# EAGLE design TinyLispComputer (EAGLE 7.6.0)

## Sheet 1 of 2
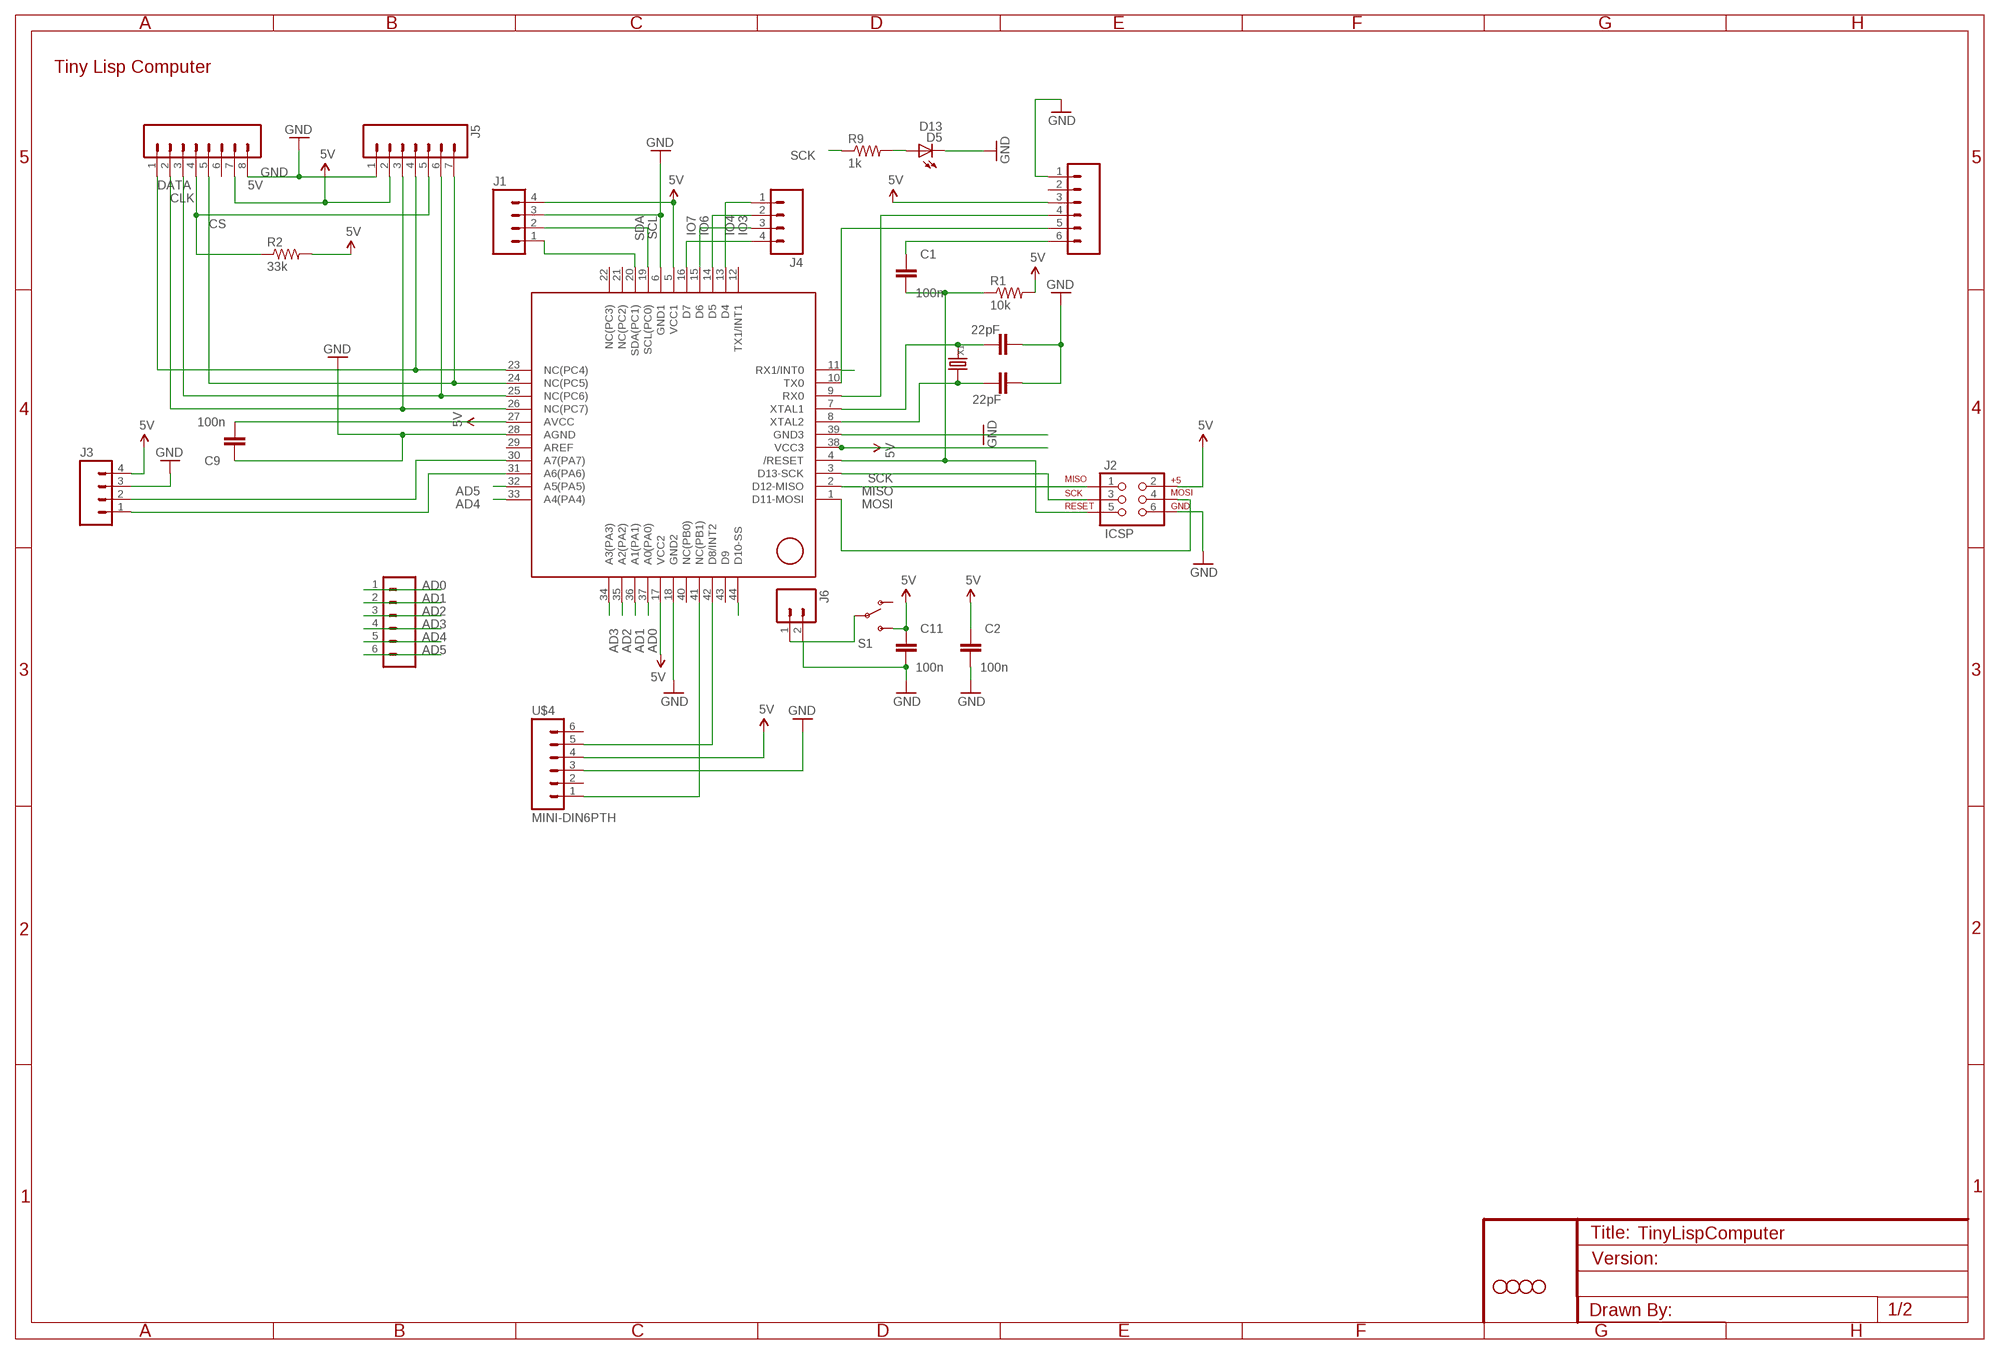
[diagram p0: schematic, sheet 1]

### Parts
C1  100n  CAP0603-CAP  [0603-CAP]
C2  100n  CAP0603-CAP  [0603-CAP]
C9  100n  CAP0603-CAP  [0603-CAP]
C11  100n  CAP0603-CAP  [0603-CAP]
C12  22pF  CAP0603-CAP  [0603-CAP]
C13  22pF  CAP0603-CAP  [0603-CAP]
D5  D13  LEDCHIPLED_0805  [CHIPLED_0805]
J1  M04LONGPADS  [1X04_LONGPADS]
J2  ICSP  AVR_SPI_PRG_6PTH  [2X3]
J3  M04LONGPADS  [1X04_LONGPADS]
J4  M04LONGPADS  [1X04_LONGPADS]
J5  M07  [1X07]
J6  M021X02_NO_SILK  [1X02_NO_SILK]
JP1  M06LONGPADS  [1X06_LONGPADS]
JP3  STAND-OFF  [STAND-OFF]
JP4  STAND-OFF  [STAND-OFF]
JP5  STAND-OFF  [STAND-OFF]
JP6  STAND-OFF  [STAND-OFF]
JP11  M06LONGPADS  [1X06_LONGPADS]
OLED  M08  [1X08_ROUND]
R1  10k  0.3OHM-1/8W-1%(0805)  [0805]
R2  33k  0.3OHM-1/8W-1%(0805)  [0805]
R9  1k  0.3OHM-1/8W-1%(0805)  [0805]
S1  SWITCH-SPDTPTH  [SWITCH-SPDT]
U3  ATMEGA1284P  [TQFP44]
U$4  MINI-DIN6PTH  [MINI-DIN6]
X1  CRYSTAL-0500290P1  [2P-SMD-5.0X3.2]

### Nets
5V: C2.1 C9.2 C11.1 J1.4 J2.2 J3.4 J5.2 JP1.3 OLED.7 R1.2 R2.2 S1.3(S) U3.5(VCC1) U3.17(VCC2) U3.27(AVCC) U3.38(VCC3) U$4.4
AD0: JP11.1 U3.37(A0(PA0))
AD1: JP11.2 U3.36(A1(PA1))
AD2: JP11.3 U3.35(A2(PA2))
AD3: JP11.4 U3.34(A3(PA3))
AD4: JP11.5 U3.33(A4(PA4))
AD5: JP11.6 U3.32(A5(PA5))
CLK: J5.6 OLED.3 U3.25(NC(PC6))
CS: J5.4 OLED.1 U3.23(NC(PC4))
DATA: J5.3 OLED.2 U3.26(NC(PC7))
GND: C2.2 C9.1 C11.2 C12.1 C13.1 D5.C J1.3 J2.6 J3.3 J5.1 J6.2 JP1.1 OLED.8 U3.6(GND1) U3.18(GND2) U3.28(AGND) U3.39(GND3) U$4.3
IO2: U3.11(RX1/INT0)
IO3: J4.1 U3.13(D4)
IO4: J4.2 U3.14(D5)
IO6: J4.3 U3.15(D6)
IO7: J4.4 U3.16(D7)
MISO: J2.1 U3.2(D12-MISO)
MOSI: J2.4 U3.1(D11-MOSI)
N$1: J5.7 OLED.5 U3.24(NC(PC5))
N$2: J6.1 S1.2(P)
N$3: C1.1 JP1.6
N$4: J5.5 OLED.4 R2.1
N$5: J3.1 U3.31(A6(PA6))
N$6: C1.2 J2.5 R1.1 U3.4(/RESET)
N$7: U3.42(D8/INT2) U$4.5
N$8: U3.41(NC(PB1)) U$4.1
N$9: J3.2 U3.30(A7(PA7))
N$11: D5.A R9.2
N$14: C13.2 U3.8(XTAL2) X1.2
N$16: C12.2 U3.7(XTAL1) X1.1
RX-I: JP1.4 U3.9(RX0)
SCK: J2.3 R9.1 U3.3(D13-SCK)
SCL: J1.2 U3.19(SCL(PC0))
SDA: J1.1 U3.20(SDA(PC1))
SS: U3.44(D10-SS)
TX-O: JP1.5 U3.10(TX0)
Unconnected: JP1.2 OLED.6 S1.1(O) U3.12(TX1/INT1) U3.21(NC(PC2)) U3.22(NC(PC3)) U3.29(AREF) U3.40(NC(PB0)) U3.43(D9) U$4.2 U$4.6

### Notes on the sheet
- Tiny Lisp Computer

## Sheet 2 of 2

## Library data of the parts
C1 C2 C9 C11-C13 = SparkFun-Capacitors:CAP: Capacitor Standard 0603 ceramic capacitor, and 0.1" leaded capacitor.
D5 = adafruit:LED: LED OSRAM: - CHIPLED LG R971, LG N971, LY N971, LG Q971, LY Q971, LO R971, LY R971 LH N974, LH R974 LS Q976, LO Q976, LY Q976 LO Q996 - Hyper CHIPLED LW Q18S LB Q993, LB Q99A, LB R99A - SideLED LS A670, LO A670, LY A670, LG A670, LP A670 LB A673, LV A673, LT A673, LW A673 LH A674 LY A675 LS A676, LA A676, LO A676, LY A676, LW A676 LS A679, LY A679, LG A679 - Hyper Micro SIDELED® LS Y876, LA Y876, LO Y876, LY Y876 LT Y87S - SmartLED LW L88C, LW L88S LB L89C, LB L89S, LG L890 LS L89K, LO L89K, LY L89K LS L896, LA L896, LO L896, LY L896 - TOPLED LS T670, LO T670, LY T670, LG T670, LP T670 LSG T670, LSP T670, LSY T670, LOP T670, LYG T670 LG T671, LOG T671, LSG T671 LB T673, LV T673, LT T673, LW T673 LH T674 LS T676, LA T676, LO T676, LY T676, LB T676, LH T676, LSB T676, LW T676 LB T67C, LV T67C, LT T67C, LS T67K, LO T67K, LY T67K, LW E67C LS E67B, LA E67B, LO E67B, LY E67B, LB E67C, LV E67C, LT E67C LW T67C LS T679, LY T679, LG T679 LS T770, LO T770, LY T770, LG T770, LP T770 LB T773, LV T773, LT T773, LW T773 LH T774 LS E675, LA E675, LY E675, LS T675 LS T776, LA T776, LO T776, LY T776, LB T776 LHGB T686 LT T68C, LB T68C - Hyper Mini TOPLED® LB M676 - Mini TOPLED Santana® LG M470 LS M47K, LO M47K, LY M47K Source: http://www.osram.convergy.de/
J1 J3 J4 = SparkFun-Connectors:M04: Header 4 Standard 4-pin 0.1" header. Use with straight break away headers (SKU : PRT-00116), right angle break away headers (PRT-00553), swiss pins (PRT-00743), machine pins (PRT-00117), and female headers (PRT-00115). Molex polarized connector foot print use with SKU : PRT-08231 with associated crimp pins and housings. 1MM SMD Version SKU: PRT-10208; PROD_ID: CONN-09696
J2 = SparkFun:AVR_SPI_PRG_6: AVR ISP 6 Pin This is the reduced ISP connector for AVR programming. Common on Arduino. This footprint will take up less PCB space and can be used with a 10-pin to 6-pin adapter such as SKU: BOB-08508
J5 = SparkFun-Connectors:M07: Header 7 Standard 7-pin 0.1" header. Use with straight break away headers (SKU : PRT-00116), right angle break away headers (PRT-00553), swiss pins (PRT-00743), machine pins (PRT-00117), and female headers (PRT-00115). NOTES ON THE VARIANTS LOCK and LOCK_LONGPADS... This footprint was designed to help hold the alignment of a through-hole component (i.e. 7-pin header) while soldering it into place. You may notice that each hole has been shifted either up or down by 0.005 of an inch from it's more standard position (which is usually a perfectly straight line). This slight alteration caused the pins (the squares in the middle) to touch the edges of the holes. Because they are alternating, it causes a "brace" to hold the header in place. 0.005 has proven to be the perfect amount of "off-center" position when using our standard breakaway headers. Although looks a little odd when you look at the bare footprint, once you have a header in there, the alteration is very hard to notice. Also, if you push a header all the way into place, it is covered up entirely on the bottom side. This idea of altering the position of holes to aid alignment will be further integrated into the Sparkfun Library for other footprints. It can help hold any component with 3 or more connection pins.
J6 = SparkFun-Connectors:M02: Standard 2-pin 0.1" header. Use with - straight break away headers ( PRT-00116) - right angle break away headers (PRT-00553) - swiss pins (PRT-00743) - machine pins (PRT-00117) - female headers (PRT-00115) Molex polarized connector foot print use with: PRT-08233 with associated crimp pins and housings. 2.54_SCREWTERM for use with PRT-10571. 3.5mm Screw Terminal footprints for PRT-08084 5mm Screw Terminal footprints for use with PRT-08432
JP1 JP11 = SparkFun-Connectors:M06: Header 6 Standard 6-pin 0.1" header. Use with straight break away headers (SKU : PRT-00116), right angle break away headers (PRT-00553), swiss pins (PRT-00743), machine pins (PRT-00117), and female headers (PRT-00115). Molex polarized connector foot print use with SKU : PRT-08094 with associated crimp pins and housings. NOTES ON THE VARIANTS LOCK and LOCK_LONGPADS... This footprint was designed to help hold the alignment of a through-hole component (i.e. 6-pin header) while soldering it into place. You may notice that each hole has been shifted either up or down by 0.005 of an inch from it's more standard position (which is a perfectly straight line). This slight alteration caused the pins (the squares in the middle) to touch the edges of the holes. Because they are alternating, it causes a "brace" to hold the component in place. 0.005 has proven to be the perfect amount of "off-center" position when using our standard breakaway headers. Although looks a little odd when you look at the bare footprint, once you have a header in there, the alteration is very hard to notice. Also,if you push a header all the way into place, it is covered up entirely on the bottom side. This idea of altering the position of holes to aid alignment will be further integrated into the Sparkfun Library for other footprints. It can help hold any component with 3 or more connection pins.
JP3-JP6 = SparkFun:STAND-OFF: Stand Off This is the mechanical footprint for a #4 phillips button head screw. Use the keepout ring to avoid running the screw head into surrounding components. SKU : PRT-00447
OLED = SparkFun-Connectors:M08: Header 8 Standard 8-pin 0.1" header. Use with straight break away headers (SKU : PRT-00116), right angle break away headers (PRT-00553), swiss pins (PRT-00743), machine pins (PRT-00117), and female headers (PRT-00115).; PROD_ID: CONN-08437
R1 R2 R9 = SparkFun-Resistors:0.3OHM-1/8W-1%(0805): RES-11622; PROD_ID: RES-11622; VALUE: 0.3
S1 = SparkFun-Electromechanical:SWITCH-SPDT: SPDT Switch Simple slide switch, Spark Fun Electronics SKU : COM-00102 DPDT SMT slide switch, AYZ0202, SWCH-08179; PROD_ID: SWCH-08261
U3 = K-Duino:ATMEGA1284P
U$4 = SparkFun-Connectors:MINI-DIN6: mini DIN 6 Connector Commonly found on the back of a computer for PS2 keyboard and mice. Schematic and footprint are proven. Spark Fun Electronics SKU : PRT-08509
X1 = OPL Eagle Library:CRYSTAL*

## Net classes
0 default: width 0.152 mm, drill 0.305 mm, clearance 0.152 mm

## Board
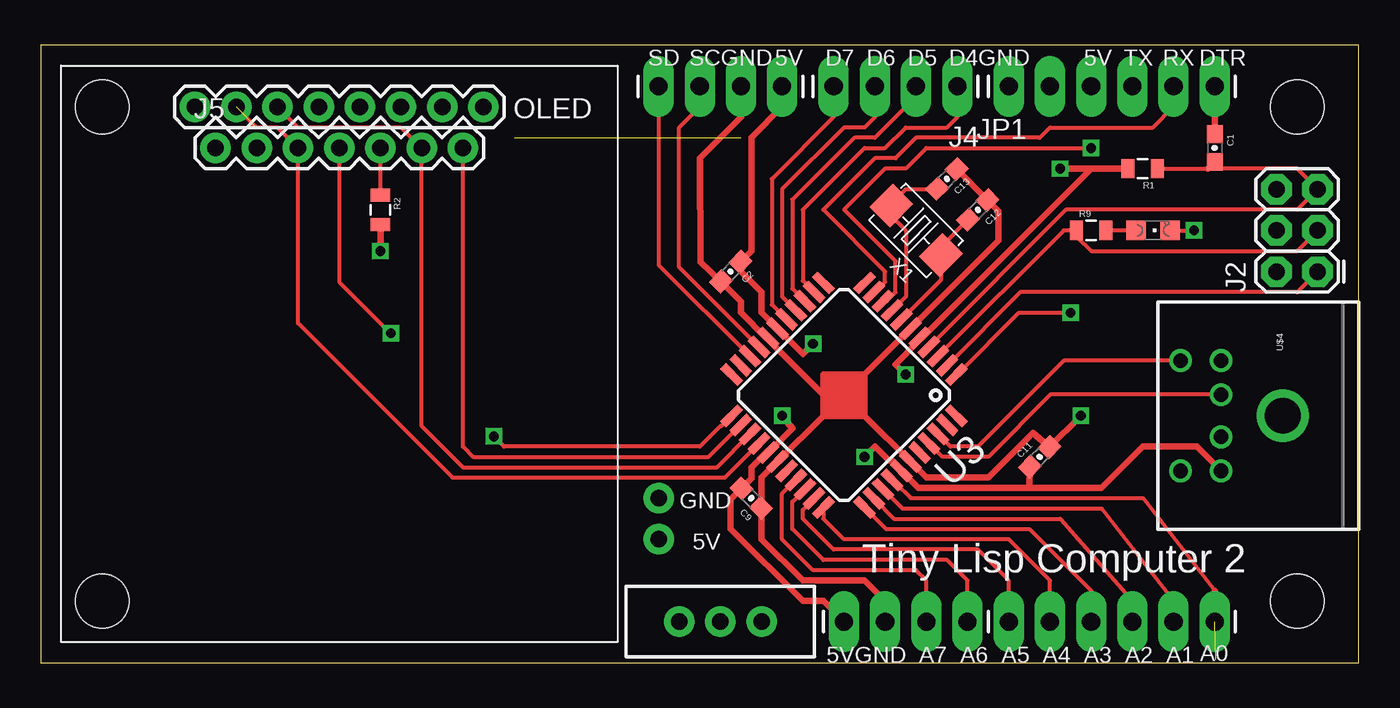
[diagram p1: board, top side]
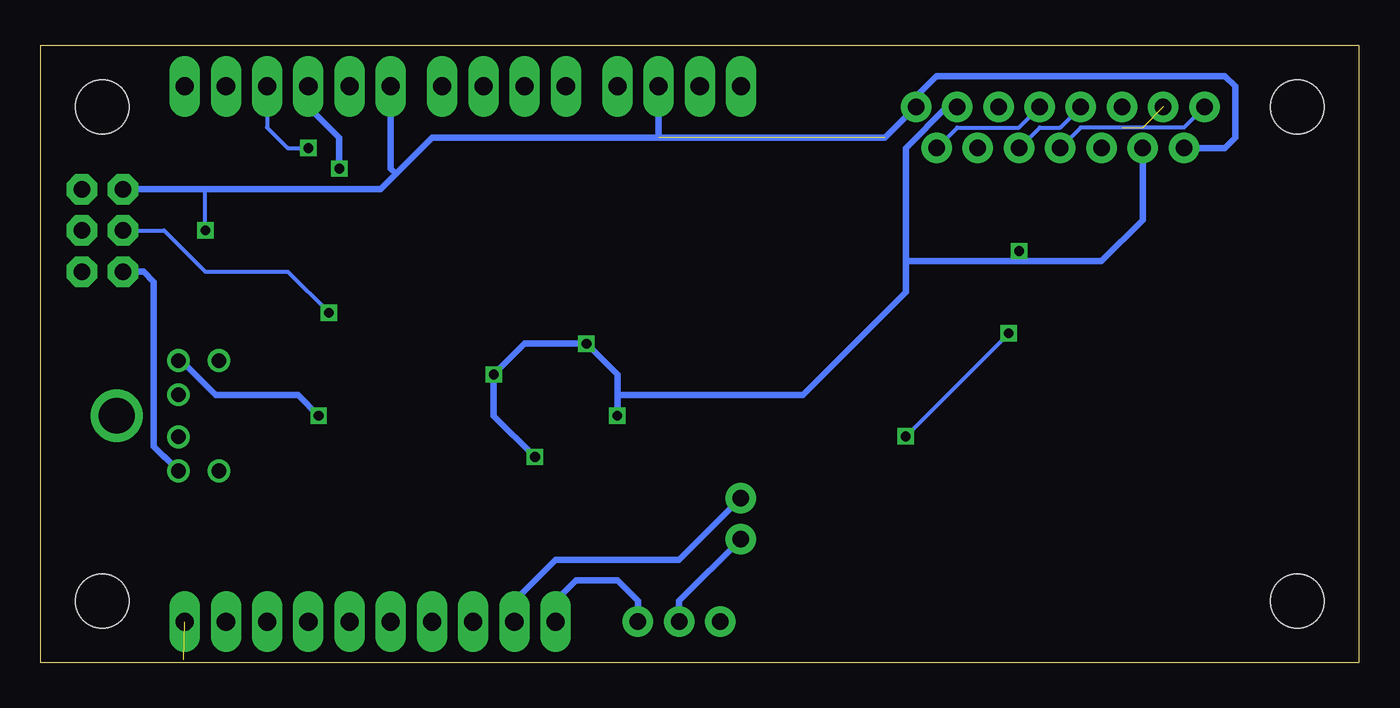
[diagram p2: board, bottom side, seen from below]

Size 81.28 x 38.1 mm. Coordinates in mm from the lower left corner, seen from the top.
Outline: 0,0 81.28,0 81.28,38.1 0,38.1 0,0
Copper layers (1*16): Top 0.035mm / dielectric 1.5mm / Bottom 0.035mm
Design rules "default": minimum track width 10mil, minimum drill 24mil, track to track 8mil, track to pad 8mil, pad to pad 8mil, via to via 8mil, smd to smd 8mil, copper to edge 40mil, drill to drill 8mil, minimum pad ring 10mil, minimum via ring 8mil, stop-mask expansion 4mil, vias tented up to drill 0mil, thermal gap 10mil

### Footprints (pad centres in the part's own frame; a part is rotated, then mirrored left to right if it is on the bottom)
0603-CAP = smd 1.1 x 1: 1 -0.85,0; 2 0.85,0
CHIPLED_0805 = smd 1.2 x 1.2: A 0,-1.05; C 0,1.05
1X04_LONGPADS = drill 1.118 pad 1.88 long: 1 0,0; 2 2.54,0; 3 5.08,0; 4 7.62,0
2X3 = drill 1.016 pad 1.88 octagon: 1 0,0; 2 0,2.54; 3 2.54,0; 4 2.54,2.54; 5 5.08,0; 6 5.08,2.54
1X07 = drill 1.016 pad 1.88: 1 0,0; 2 2.54,0; 3 5.08,0; 4 7.62,0; 5 10.16,0; 6 12.7,0; 7 15.24,0
1X02_NO_SILK = drill 1.016 pad 1.88: 1 0,0; 2 2.54,0
1X06_LONGPADS = drill 1.118 pad 1.88 long: 1 0,0; 2 2.54,0; 3 5.08,0; 4 7.62,0; 5 10.16,0; 6 12.7,0
STAND-OFF = hole 3.302: 0,0
1X08_ROUND = drill 1.016 pad 1.88: 1 0,0; 2 2.54,0; 3 5.08,0; 4 7.62,0; 5 10.16,0; 6 12.7,0; 7 15.24,0; 8 17.78,0
0805 = smd 0.8 x 1.2: 1 -0.9,0; 2 0.9,0
SWITCH-SPDT = drill 1.016 pad 1.88: 1 0,2.54; 2 0,0; 3 0,-2.54
TQFP44 = smd 1.5 x 0.5: 1 -5.8,4; 2 -5.8,3.2; 3 -5.8,2.4; 4 -5.8,1.6; 5 -5.8,0.8; 6 -5.8,0; 7 -5.8,-0.8; 8 -5.8,-1.6; 9 -5.8,-2.4; 10 -5.8,-3.2; 11 -5.8,-4; 23 5.8,-4; 24 5.8,-3.2; 25 5.8,-2.4; 26 5.8,-1.6; 27 5.8,-0.8; 28 5.8,0; 29 5.8,0.8; 30 5.8,1.6; 31 5.8,2.4; 32 5.8,3.2; 33 5.8,4 | smd 0.5 x 1.5: 12 -4,-5.8; 13 -3.2,-5.8; 14 -2.4,-5.8; 15 -1.6,-5.8; 16 -0.8,-5.8; 17 0,-5.8; 18 0.8,-5.8; 19 1.6,-5.8; 20 2.4,-5.8; 21 3.2,-5.8; 22 4,-5.8; 34 4,5.8; 35 3.2,5.8; 36 2.4,5.8; 37 1.6,5.8; 38 0.8,5.8; 39 0,5.8; 40 -0.8,5.8; 41 -1.6,5.8; 42 -2.4,5.8; 43 -3.2,5.8; 44 -4,5.8
MINI-DIN6 = drill 0.9: 1 -1.3,-8.5; 2 1.3,-8.5; 3 -3.4,-8.5; 4 3.4,-8.5; 5 -3.4,-11; 6 3.4,-11 | drill 2.2: P$1 0,-4.7
2P-SMD-5.0X3.2 = smd 1.778 x 2.032: 1 -2.159,0; 2 2.159,0

### Placement (x,y rotation side)
C1  72.39,31.75 270 top
C2  42.55,24.13 225 top
C9  43.81,10.16 135 top
C11  61.59,12.7 45 top
C12  57.78,27.94 225 top
C13  55.88,29.84 225 top
D5  68.58,26.67 270 top
J1  38.1,35.56 0 top
J2  78.74,24.13 90 top
J3  57.15,2.54 180 top
J4  56.52,35.56 180 top
J5  10.79,31.75 0 top
J6  38.1,7.62 90 top
JP1  59.69,35.56 0 top
JP3  3.81,34.29 0 top
JP4  77.47,3.81 0 top
JP5  3.81,3.81 0 top
JP6  77.47,34.29 0 top
JP11  72.39,2.54 180 top
OLED  9.53,34.29 0 top
R1  67.94,30.48 180 top
R2  20.95,27.94 270 top
R9  64.77,26.67 0 top
S1  41.91,2.54 90 top
U3  49.53,16.51 225 top
U$4  81.28,15.24 270 top
X1  53.98,26.67 135 top

### Tracks (layer width: path | path; a pad name or v marks a point on that pad's centre or on a via)
5V  (via drill 0.6)
  Top 0.254: 52.48,12.47 52.93,12.01 U3.38 | U3.27 44.72,12.97
  Top 0.406: 60.96,10.8 54.11,10.8 U3.38 | 44.72,12.97 43.81,12.07 43.81,11.36 C9.2 42.55,10.09 42.55,8.25 46.99,3.81 48.26,3.81 J3.4 | C11.1 60.96,10.8 | 60.96,10.8 65.41,10.8 67.94,13.34 71.28,13.34 U$4.4 | 64.77,30.48 54.34,20.05 U3.5 54.2,19.91 52.7,18.41 v53.34,17.78 | 64.77,30.48 R1.2 | v62.87,30.48 64.77,30.48 | U3.17 | v45.72,15.24 46.35,14.47 U3.27 | R2.2 v20.95,25.4 | U3.17 46.99,19.05 v47.62,19.69 | 52.48,12.47 52.3,12.47 51.44,13.34 v50.8,12.7 | J1.4 45.72,34.29 43.81,32.38 43.81,25.4 C2.1 43.15,24.16 44.45,22.86 44.45,21.59 U3.17
  Bottom 0.254: 73.66,12.7 73.64,12.7
  Bottom 0.406: J2.2 74.93,24.13 74.3,23.5 74.3,13.34 73.66,12.7 | 73.64,12.7 U$4.4 | 45.72,16.51 45.72,17.78 v47.62,19.69 51.44,19.69 v53.34,17.78 53.34,15.24 v50.8,12.7 | 45.72,16.51 v45.72,15.24 | J5.2 13.34,27.3 15.88,24.77 20.95,24.77 | 27.94,24.77 27.94,31.75 25.4,34.29 OLED.7 | 27.94,24.77 20.95,24.77 | 27.94,24.77 27.94,22.86 34.29,16.51 45.72,16.51 | JP1.3 64.77,34.29 62.87,32.38 v62.87,30.48 | J3.4 49.53,3.81 48.26,5.08 45.72,5.08 44.45,3.81 S1.3 | v20.95,25.4 20.95,24.77
AD0  (1 unrouted)
  Top 0.254: U3.37 52.7,11.1 53.65,10.16 67.94,10.16 72.39,4.45
  Top 0.406: 72.39,4.45 JP11.1
AD1
  Top 0.254: U3.36 52.02,10.64 53.14,9.52 65.41,9.52 69.85,3.81
  Top 0.406: 69.85,3.81 JP11.2
AD2
  Top 0.254: U3.35 52.62,8.89 62.87,8.89 67.31,3.81
  Top 0.406: 67.31,3.81 JP11.3
AD3
  Top 0.254: U3.34 52.13,8.25 60.96,8.25 64.77,4.45 JP11.4
AD4
  Top 0.254: JP11.5 62.23,5.08 59.69,7.62 49.53,7.62 48.26,8.89 U3.33
AD5
  Top 0.254: 47.68,9.96 U3.32 46.99,9.45 46.99,8.89 48.9,6.99 57.78,6.99 59.69,5.08 JP11.6
CLK
  Top 0.254: U3.25 41.69,12.07 26.04,12.07 23.5,14.61 J5.6 22.23,33.02 15.88,33.02 OLED.3
CS  (via drill 0.6)
  Top 0.254: U3.23 41.97,14.6 41.91,14.6 40.64,13.34 28.57,13.34 v27.94,13.97 | J5.4 18.41,23.5 v21.59,20.32
  Bottom 0.254: v21.59,20.32 v27.94,13.97 | OLED.1 10.79,33.02 17.14,33.02 J5.4
DATA  (2 unrouted)
  Top 0.254: U3.26 42.19,11.43 25.4,11.43 15.88,20.96 J5.3 14.61,33.02 13.34,33.02 OLED.2
GND  (via drill 0.6)  (1 unrouted)
  Top 0.254: 45.39,12.24 U3.28 | 44.45,9.59 C9.1 | D5.C v71.12,26.67
  Top 0.406: 50.8,15.24 U3.39 54.61,11.43 58.42,11.43 61.17,14.19 C11.2 v64.14,15.24 | 50.8,15.24 48.26,15.24 | 48.26,15.24 U3.28 44.45,11.43 44.45,9.59 | C13.1 C12.1 59.05,27.87 59.05,26.04 U3.6 50.8,17.78 | 48.26,16.51 44.86,19.91 U3.18 44.72,20.05 43.18,21.59 43.18,22.29 C2.2 40.67,24.73 40.64,31.12 43.18,33.66 J1.3 | 48.26,16.51 48.26,15.24 | 50.8,15.24 50.8,17.78 | 50.8,17.78 48.26,17.78 48.26,16.51 | J3.3 52.07,3.81 50.8,5.08 46.99,5.08 44.45,7.62 44.45,9.52 C9.1
  Bottom 0.254: v71.12,26.67 71.12,29.21
  Bottom 0.406: U$4.3 72.61,18.64 70.48,16.51 65.41,16.51 v64.14,15.24 | J2.6 71.12,29.21 60.33,29.21 59.37,30.16 | 59.37,30.16 57.15,32.38 43.18,32.38 | 43.18,32.38 29.21,32.38 OLED.8 27.3,34.93 26.04,36.2 8.26,36.2 7.62,35.56 7.62,32.38 8.26,31.75 J5.1 | JP1.1 59.69,30.48 59.37,30.16 | J3.3 52.07,3.81 49.53,6.35 41.91,6.35 J6.2 | J1.3 43.18,32.38
IO3
  Top 0.254: U3.13 46.99,23.57 46.99,27.94 50.8,31.75 52.07,31.75 53.34,33.02 55.88,33.02 56.52,33.66 J4.1
IO4
  Top 0.254: J4.2 53.98,34.93 51.44,32.38 50.16,32.38 46.35,28.57 46.35,23.08 U3.14
IO6
  Top 0.254: J4.3 51.44,33.66 50.8,33.02 49.53,33.02 45.72,29.21 45.72,22.58 U3.15
IO7
  Top 0.254: J4.4 48.9,33.66 45.09,29.84 45.09,22.09 U3.16
MISO
  Top 0.254: J2.1 77.47,22.86 60.41,22.86 U3.2
MOSI  (via drill 0.6)
  Top 0.254: U3.1 56.52,17.78 60.33,21.59 v63.5,21.59
  Bottom 0.254: J2.4 73.66,26.67 71.12,24.13 66.04,24.13 v63.5,21.59
N$1
  Top 0.254: U3.24 41.2,12.7 26.67,12.7 26.04,13.34 J5.7
  Bottom 0.254: J5.7 24.77,33.02 20.95,33.02 OLED.5
N$2
  Bottom 0.406: J6.1 41.91,3.81 S1.2
N$3
  Top 0.406: C1.1 JP1.6
N$4
  Top 0.254: R2.1 J5.5
  Bottom 0.254: J5.5 19.68,33.02 18.41,33.02 OLED.4
N$5
  Top 0.254: J3.1 57.15,5.08 55.88,6.35 48.26,6.35 46.35,8.25 46.35,9.94 U3.31
N$6
  Top 0.254: U3.4 63.22,27.94 77.47,27.94 J2.5 77.47,30.48 72.81,30.48 C1.2 | R1.1 71.97,30.48
  Top 0.406: 71.97,30.48 C1.2
N$7
  Top 0.254: U$4.5 63.09,18.64 57.78,13.34 56.1,13.34 U3.42
N$8
  Top 0.254: U$4.1 62.26,16.54 58.42,12.7 55.6,12.7 U3.41
N$9
  Top 0.254: J3.2 54.61,5.08 53.98,5.72 47.62,5.72 45.72,7.62 45.72,10.44 U3.30
N$11
  Top 0.254: D5.A R9.2
N$14
  Top 0.254: 52.7,21.84 U3.8 53.34,22.58 53.34,26.67 52.45,27.56 X1.2 52.45,28.32 53.34,29.21 55.24,29.21 C13.2
N$16
  Top 0.254: U3.7 55.5,23.61 X1.1 55.5,25.66 C12.2
RX-I  (via drill 0.6)
  Top 0.254: U3.9 52.15,22.31 52.7,22.86 52.7,24.77 49.53,27.94 52.07,30.48 53.34,30.48 54.61,31.75 v64.77,31.75
  Bottom 0.254: JP1.4 67.31,33.02 66.04,31.75 v64.77,31.75
SCK
  Top 0.254: 55.45,19.1 U3.3 63.08,26.67 R9.1 63.87,26.3 64.77,25.4 77.47,25.4 J2.3
SCL
  Top 0.254: U3.19 39.37,24.41 39.37,33.02 40.64,34.29 J1.2
SDA
  Top 0.254: J1.1 38.1,24.55 U3.20
TX-O
  Top 0.254: U3.10 51.45,22.87 52.07,23.5 52.07,24.13 48.26,27.94 51.44,31.12 52.7,31.12 53.98,32.38 61.59,32.38 62.23,33.02 68.58,33.02 69.85,34.29 JP1.5
(copper drawn outside any net)
  shapes: Top area x1

### Text on the board
tPlace: SD | SC | GND | 5V | D7 | D6 | D5 | D4 | GND | 5V | TX | RX | DTR | GND | 5V | Tiny Lisp Computer 2 | 5V | GND | A7 | A6 | A5 | A4 | A3 | A2 | A1 | A0